# EAGLE schematic pcb (EAGLE 6.1)
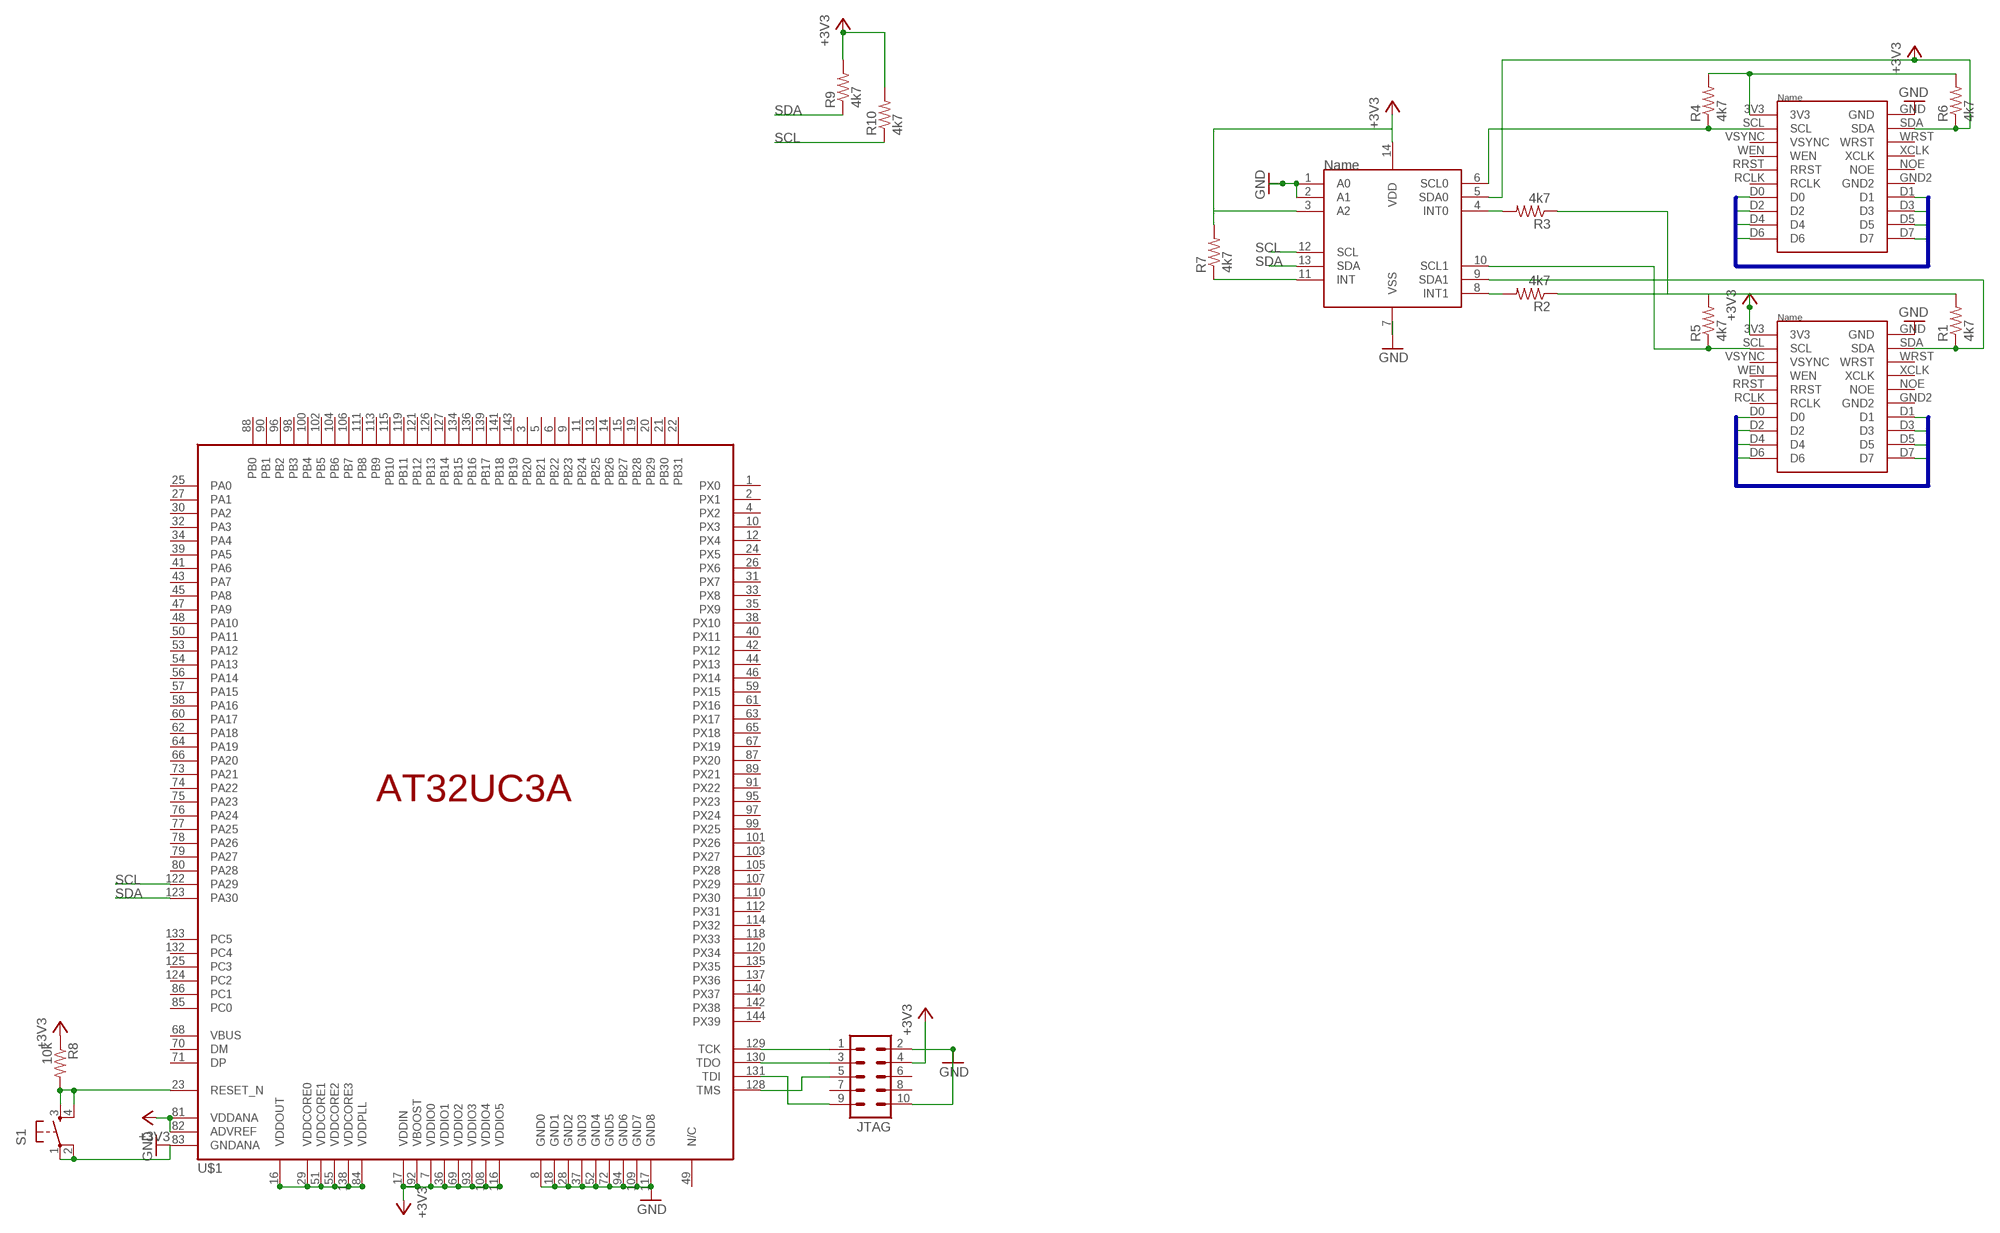
[diagram p0: schematic, sheet 1]

## Parts
I2CMUX  PCA9542A  [TSSOP14]
JTAG  MA05-2  [MA05-2]
OV0  OV7670  [OV7670]
OV1  OV7670  [OV7670]
R1  4k7  RESISTOR0603-RES  [0603-RES]
R2  4k7  RESISTOR0603-RES  [0603-RES]
R3  4k7  RESISTOR0603-RES  [0603-RES]
R4  4k7  RESISTOR0603-RES  [0603-RES]
R5  4k7  RESISTOR0603-RES  [0603-RES]
R6  4k7  RESISTOR0603-RES  [0603-RES]
R7  4k7  RESISTOR0603-RES  [0603-RES]
R8  10k  RESISTOR0603-RES  [0603-RES]
R9  4k7  RESISTOR0603-RES  [0603-RES]
R10  4k7  RESISTOR0603-RES  [0603-RES]
S1  TAC_SWITCHSMD  [TACTILE_SWITCH_SMD]
U$1  AVR32UC3AVQFP144  [VQFP144]

## Nets
+3V3: I2CMUX.3(A2) I2CMUX.5(SDA0) I2CMUX.14(VDD) JTAG.4 OV0.SDA OV1.3V3 R1.2 R2.1 R3.1 R5.2 R6.1 R7.2 R8.1 R9.2 R10.2 U$1.7(VDDIO0) U$1.17(VDDIN) U$1.36(VDDIO1) U$1.69(VDDIO2) U$1.81(VDDANA) U$1.82(ADVREF) U$1.92(VBOOST) U$1.93(VDDIO3) U$1.108(VDDIO4) U$1.116(VDDIO5)
GND: I2CMUX.1(A0) I2CMUX.2(A1) I2CMUX.7(VSS) JTAG.2 JTAG.10 OV0.GND OV1.GND S1.1 S1.2 U$1.8(GND0) U$1.18(GND1) U$1.28(GND2) U$1.37(GND3) U$1.52(GND4) U$1.72(GND5) U$1.83(GNDANA) U$1.94(GND6) U$1.109(GND7) U$1.117(GND8)
N$1: I2CMUX.6(SCL0) OV0.SCL R4.1
N$2: U$1.16(VDDOUT) U$1.29(VDDCORE0) U$1.51(VDDCORE1) U$1.55(VDDCORE2) U$1.84(VDDPLL) U$1.138(VDDCORE3)
N$3: OV0.3V3 R4.2 R6.2
N$4: R8.2 S1.3 S1.4 U$1.23(RESET_N)
N$5: I2CMUX.9(SDA1) OV1.SDA R1.1
N$6: I2CMUX.10(SCL1) OV1.SCL R5.1
N$7: JTAG.1 U$1.129(TCK)
N$8: JTAG.3 U$1.130(TDO)
N$9: JTAG.5 U$1.128(TMS)
N$10: I2CMUX.8(INT1) R2.2
N$11: I2CMUX.4(INT0) R3.2
N$12: JTAG.9 U$1.131(TDI)
N$13: I2CMUX.11(INT) R7.1
OV1DATA0: OV1.D0
OV1DATA1: OV1.D1
OV1DATA2: OV1.D2
OV1DATA3: OV1.D3
OV1DATA4: OV1.D4
OV1DATA5: OV1.D5
OV1DATA6: OV1.D6
OV1DATA7: OV1.D7
OVDATA0: OV0.D0
OVDATA1: OV0.D1
OVDATA2: OV0.D2
OVDATA3: OV0.D3
OVDATA4: OV0.D4
OVDATA5: OV0.D5
OVDATA6: OV0.D6
OVDATA7: OV0.D7
SCL: I2CMUX.12(SCL) R10.1 U$1.122(PA29)
SDA: I2CMUX.13(SDA) R9.1 U$1.123(PA30)
Unconnected: JTAG.6 JTAG.7 JTAG.8 OV0.NOE OV0.RCLK OV0.RRST OV0.VSYNC OV0.WEN OV0.WRST OV0.XCLK OV1.NOE OV1.RCLK OV1.RRST OV1.VSYNC OV1.WEN OV1.WRST OV1.XCLK U$1.1(PX0) U$1.2(PX1) U$1.3(PB20) U$1.4(PX2) U$1.5(PB21) U$1.6(PB22) U$1.9(PB23) U$1.10(PX3) U$1.11(PB24) U$1.12(PX4) U$1.13(PB25) U$1.14(PB26) U$1.15(PB27) U$1.19(PB28) U$1.20(PB29) U$1.21(PB30) U$1.22(PB31) U$1.24(PX5) U$1.25(PA0) U$1.26(PX6) U$1.27(PA1) U$1.30(PA2) U$1.31(PX7) U$1.32(PA3) U$1.33(PX8) U$1.34(PA4) U$1.35(PX9) U$1.38(PX10) U$1.39(PA5) U$1.40(PX11) U$1.41(PA6) U$1.42(PX12) U$1.43(PA7) U$1.44(PX13) U$1.45(PA8) U$1.46(PX14) U$1.47(PA9) U$1.48(PA10) U$1.49(N/C) U$1.50(PA11) U$1.53(PA12) U$1.54(PA13) U$1.56(PA14) U$1.57(PA15) U$1.58(PA16) U$1.59(PX15) U$1.60(PA17) U$1.61(PX16) U$1.62(PA18) U$1.63(PX17) U$1.64(PA19) U$1.65(PX18) U$1.66(PA20) U$1.67(PX19) U$1.68(VBUS) U$1.70(DM) U$1.71(DP) U$1.73(PA21) U$1.74(PA22) U$1.75(PA23) U$1.76(PA24) U$1.77(PA25) U$1.78(PA26) U$1.79(PA27) U$1.80(PA28) U$1.85(PC0) U$1.86(PC1) U$1.87(PX20) U$1.88(PB0) U$1.89(PX21) U$1.90(PB1) U$1.91(PX22) U$1.95(PX23) U$1.96(PB2) U$1.97(PX24) U$1.98(PB3) U$1.99(PX25) U$1.100(PB4) U$1.101(PX26) U$1.102(PB5) U$1.103(PX27) U$1.104(PB6) U$1.105(PX28) U$1.106(PB7) U$1.107(PX29) U$1.110(PX30) U$1.111(PB8) U$1.112(PX31) U$1.113(PB9) U$1.114(PX32) U$1.115(PB10) U$1.118(PX33) U$1.119(PB11) U$1.120(PX34) U$1.121(PB12) U$1.124(PC2) U$1.125(PC3) U$1.126(PB13) U$1.127(PB14) U$1.132(PC4) U$1.133(PC5) U$1.134(PB15) U$1.135(PX35) U$1.136(PB16) U$1.137(PX36) U$1.139(PB17) U$1.140(PX37) U$1.141(PB18) U$1.142(PX38) U$1.143(PB19) U$1.144(PX39)

## Buses
OVDATA[0..7]

## Power pins joined to a net without a drawn wire
GND2: OV0.GND2 OV1.GND2

## Library data of the parts
I2CMUX = seblov:PCA9542A
JTAG = con-lstb:MA05-2: PIN HEADER; OC_FARNELL: unknown; OC_NEWARK: unknown
OV0 OV1 = seblov:OV7670
R1-R10 = SparkFun:RESISTOR: Resistor Basic schematic elements and footprints for 0603, 1206, and PTH resistors.
S1 = SparkFun:TAC_SWITCH: Momentary Switch Button commonly used for reset or general input. Spark Fun Electronics SKU : COM-00097
U$1 = avr32uca:AVR32UC3A